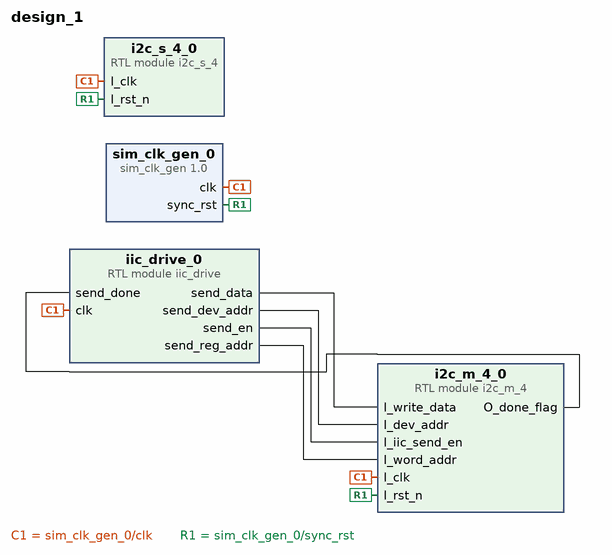
[diagram p0: block diagram of the top level]
# Vivado block design design_1, xc7z020clg400-1, Vivado 2022.1
create_bd_design design_1

create_bd_cell -type ip -vlnv xilinx.com:ip:sim_clk_gen:1.0 sim_clk_gen_0
create_bd_cell -type module -reference i2c_m_4 i2c_m_4_0
create_bd_cell -type module -reference i2c_s_4 i2c_s_4_0
create_bd_cell -type module -reference iic_drive iic_drive_0

# ---- connections ----

connect_bd_net [get_bd_pins i2c_m_4_0/O_done_flag] [get_bd_pins iic_drive_0/send_done]
connect_bd_net [get_bd_pins iic_drive_0/send_data] [get_bd_pins i2c_m_4_0/I_write_data]
connect_bd_net [get_bd_pins iic_drive_0/send_dev_addr] [get_bd_pins i2c_m_4_0/I_dev_addr]
connect_bd_net [get_bd_pins iic_drive_0/send_en] [get_bd_pins i2c_m_4_0/I_iic_send_en]
connect_bd_net [get_bd_pins iic_drive_0/send_reg_addr] [get_bd_pins i2c_m_4_0/I_word_addr]
connect_bd_net [get_bd_pins sim_clk_gen_0/clk] [get_bd_pins i2c_m_4_0/I_clk] [get_bd_pins i2c_s_4_0/I_clk] [get_bd_pins iic_drive_0/clk]
connect_bd_net [get_bd_pins sim_clk_gen_0/sync_rst] [get_bd_pins i2c_m_4_0/I_rst_n] [get_bd_pins i2c_s_4_0/I_rst_n]

validate_bd_design
save_bd_design
